# EAGLE schematic lightbulb_with_pwm (EAGLE 7.1.0)
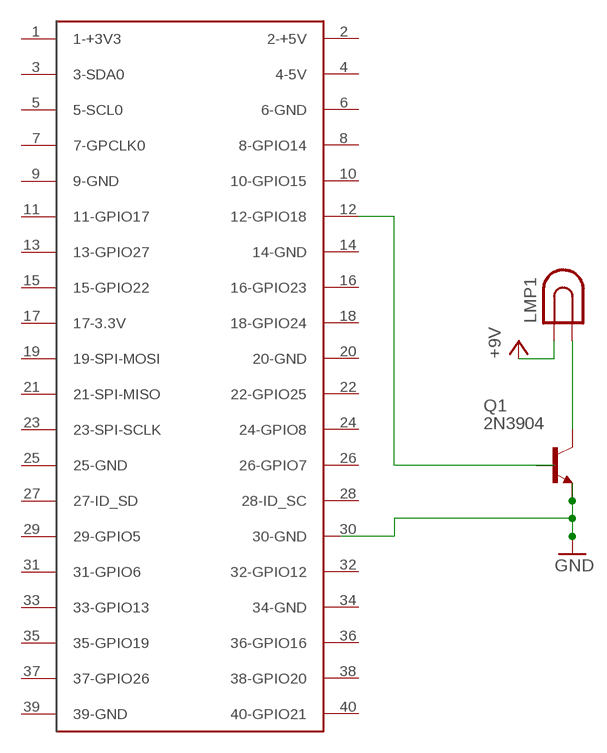
[diagram p0: schematic, sheet 1]

## Parts
LMP1  LAMP  [LDH-5R]
Q1  2N3904  [TO92]
U$2  RASPBERRY-PI  [RASPBERRY-PI]

## Nets
GND: Q1.3(E)
N$1: U$2.12(12-GPIO18)
N$2: LMP1.2 Q1.1(C)
VCC: LMP1.1 ; supply symbol labelled +9V
Unconnected: Q1.2(B) U$2.1(1-+3V3) U$2.2(2-+5V) U$2.3(3-SDA0) U$2.4(4-5V) U$2.5(5-SCL0) U$2.6(6-GND) U$2.7(7-GPCLK0) U$2.8(8-GPIO14) U$2.9(9-GND) U$2.10(10-GPIO15) U$2.11(11-GPIO17) U$2.13(13-GPIO27) U$2.14(14-GND) U$2.15(15-GPIO22) U$2.16(16-GPIO23) U$2.17(17-3.3V) U$2.18(18-GPIO24) U$2.19(19-SPI-MOSI) U$2.20(20-GND) U$2.21(21-SPI-MISO) U$2.22(22-GPIO25) U$2.23(23-SPI-SCLK) U$2.24(24-GPIO8) U$2.25(25-GND) U$2.26(26-GPIO7) U$2.27(27-ID_SD) U$2.28(28-ID_SC) U$2.29(29-GPIO5) U$2.30(30-GND) U$2.31(31-GPIO6) U$2.32(32-GPIO12) U$2.33(33-GPIO13) U$2.34(34-GND) U$2.35(35-GPIO19) U$2.36(36-GPIO16) U$2.37(37-GPIO26) U$2.38(38-GPIO20) U$2.39(39-GND) U$2.40(40-GPIO21)

## Library data of the parts
LMP1 = special:LAMP: LED HOLDER
Q1 = transistor-npn:2N3904: NPN Transistor
U$2 = aliEagleLib:RASPBERRY-PI: Raspberry Pi Board <http://www.raspberrypi.org/> Jacques Lagnel V1.0 (beta) 2012 Board dimension: Forum 3D model <http://www.raspberrypi.org/forum/general-discussion/mechanical-profile-3d-models?value=3d%20model&type=1&include=1&search=1&ret=all> The GPIO Connector (P1): http://elinux.org/RPi_Low-level_peripherals